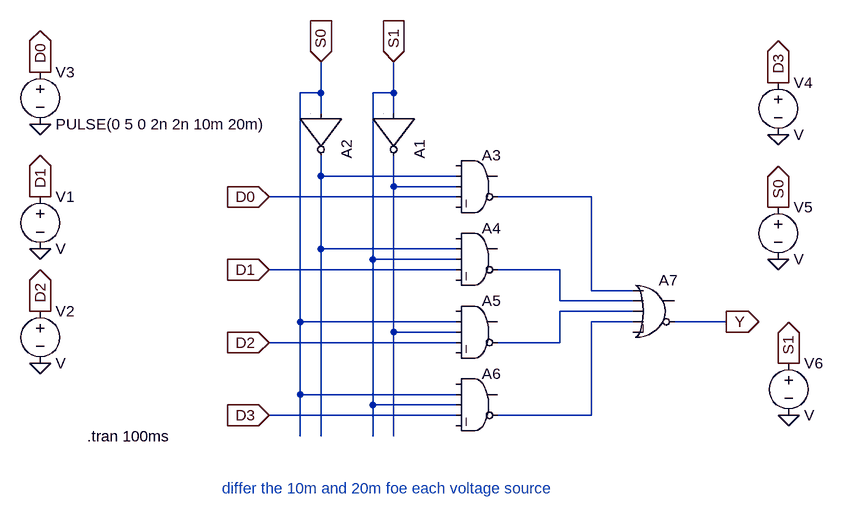
[diagram p0: schematic 4x1Mux.asc]
4x1Mux.asc, the LTspice schematic file:
Version 4
SHEET 1 892 680
WIRE 96 -32 96 -80
WIRE 96 -32 64 -32
WIRE 208 -32 208 -80
WIRE 208 -32 176 -32
WIRE 96 0 96 -32
WIRE 208 0 208 -32
WIRE 96 96 96 64
WIRE 304 96 96 96
WIRE 208 112 208 64
WIRE 304 112 208 112
WIRE 304 128 16 128
WIRE 512 128 368 128
WIRE 96 208 96 96
WIRE 304 208 96 208
WIRE 176 224 176 -32
WIRE 304 224 176 224
WIRE 304 240 16 240
WIRE 464 240 368 240
WIRE 512 272 512 128
WIRE 576 272 512 272
WIRE 464 288 464 240
WIRE 576 288 464 288
WIRE 576 304 464 304
WIRE 64 320 64 -32
WIRE 304 320 64 320
WIRE 576 320 512 320
WIRE 720 320 640 320
WIRE 208 336 208 112
WIRE 304 336 208 336
WIRE 304 352 16 352
WIRE 464 352 464 304
WIRE 464 352 368 352
WIRE 64 432 64 320
WIRE 304 432 64 432
WIRE 176 448 176 224
WIRE 304 448 176 448
WIRE 304 464 16 464
WIRE 512 464 512 320
WIRE 512 464 368 464
WIRE 64 496 64 432
WIRE 96 496 96 208
WIRE 176 496 176 448
WIRE 208 496 208 336
FLAG 16 128 D0
IOPIN 16 128 In
FLAG 16 240 D1
IOPIN 16 240 In
FLAG 16 352 D2
IOPIN 16 352 In
FLAG 16 464 D3
IOPIN 16 464 In
FLAG 96 -80 S0
IOPIN 96 -80 In
FLAG 208 -80 S1
IOPIN 208 -80 In
FLAG 720 320 Y
IOPIN 720 320 Out
FLAG -336 16 0
FLAG -336 208 0
FLAG -336 384 0
FLAG 800 32 0
FLAG 800 224 0
FLAG 816 464 0
FLAG -336 -64 D0
IOPIN -336 -64 Out
FLAG -336 128 D1
IOPIN -336 128 Out
FLAG -336 304 D2
IOPIN -336 304 Out
FLAG 800 -48 D3
IOPIN 800 -48 Out
FLAG 800 144 S0
IOPIN 800 144 Out
FLAG 816 384 S1
IOPIN 816 384 Out
SYMBOL Digital\\inv 272 0 R90
SYMATTR InstName A1
SYMBOL Digital\\inv 160 0 R90
SYMATTR InstName A2
SYMBOL Digital\\and 336 48 R0
SYMATTR InstName A3
SYMBOL Digital\\and 336 160 R0
SYMATTR InstName A4
SYMBOL Digital\\and 336 272 R0
SYMATTR InstName A5
SYMBOL Digital\\and 336 384 R0
SYMATTR InstName A6
SYMBOL Digital\\or 608 240 R0
SYMATTR InstName A7
SYMBOL voltage -336 112 R0
SYMATTR InstName V1
SYMBOL voltage -336 288 R0
SYMATTR InstName V2
SYMBOL voltage -336 -80 R0
WINDOW 123 0 0 Left 0
WINDOW 39 0 0 Left 0
SYMATTR InstName V3
SYMATTR Value PULSE(0 5 0 2n 2n 10m 20m)
SYMBOL voltage 800 -64 R0
SYMATTR InstName V4
SYMBOL voltage 800 128 R0
SYMATTR InstName V5
SYMBOL voltage 816 368 R0
SYMATTR InstName V6
TEXT -264 496 Left 2 !.tran 100ms
TEXT -56 576 Left 2 ;differ the 10m and 20m foe each voltage source

The netlist it stands for:
* 4x1Mux.asc
A1 S1 0 0 0 0 N002 0 0 BUF
A2 S0 0 0 0 0 N001 0 0 BUF
A3 0 N001 N002 D0 0 N003 0 0 AND
A4 0 N001 S1 D1 0 N004 0 0 AND
A5 0 S0 N002 D2 0 N005 0 0 AND
A6 0 S0 S1 D3 0 N006 0 0 AND
A7 N003 N004 N005 N006 0 Y 0 0 OR
V1 D1 0 V
V2 D2 0 V
V3 D0 0 PULSE(0 5 0 2n 2n 10m 20m)
V4 D3 0 V
V5 S0 0 V
V6 S1 0 V
.tran 100ms
* differ the 10m and 20m foe each voltage source
.backanno
.end